# Altium schematic sheet Power_LoadSwitches.SchDoc
size OrCAD B; SheetNumber: 4; SheetTotal: 11
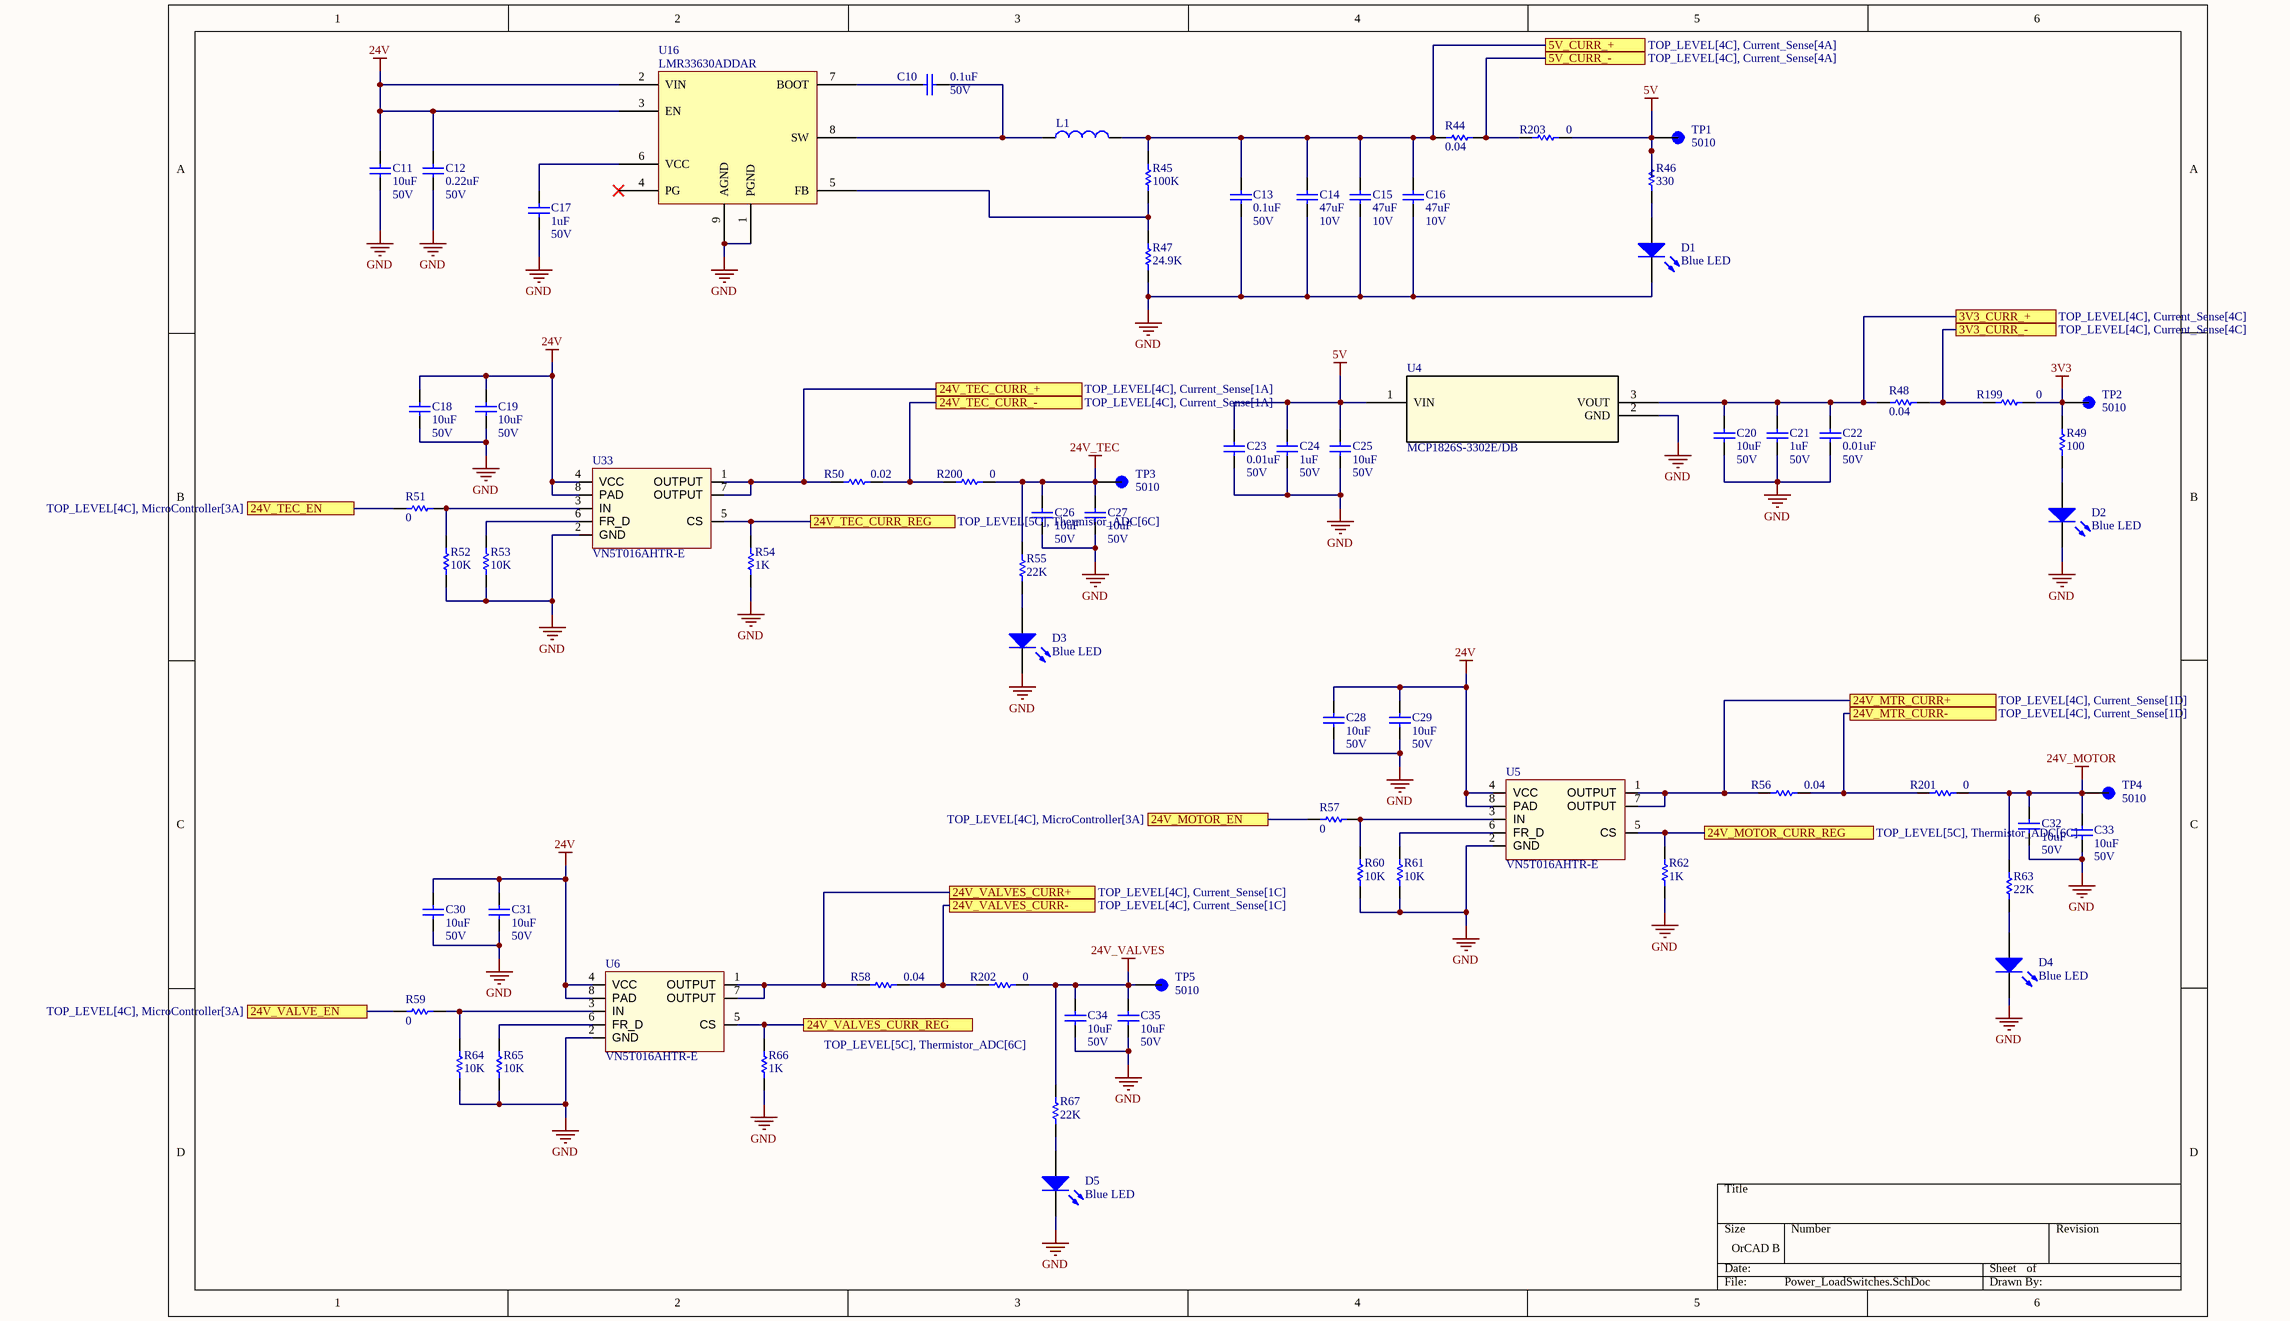
[diagram p0: Power_LoadSwitches.SchDoc]

## Parts
C10  value 0.1uF  Rating: 50V  [DEFAULT_CAPACITOR_0805]  (hidden comment: KGM21NR71H104KT)
C11  value 10uF  Rating: 50V  [DEFAULT_CAPACITOR_0805]  (hidden comment: GRM21BR61H106KE43L)
C12  value 0.22uF  Rating: 50V  [DEFAULT_CAPACITOR_0805]  (hidden comment: C0805C224K5RACTU)
C13  value 0.1uF  Rating: 50V  [DEFAULT_CAPACITOR_0805]  (hidden comment: KGM21NR71H104KT)
C14  value 47uF  Rating: 10V  [DEFAULT_CAPACITOR_0805]  (hidden comment: GRM21BR61A476ME15L)
C15  value 47uF  Rating: 10V  [DEFAULT_CAPACITOR_0805]  (hidden comment: GRM21BR61A476ME15L)
C16  value 47uF  Rating: 10V  [DEFAULT_CAPACITOR_0805]  (hidden comment: GRM21BR61A476ME15L)
C17  value 1uF  Rating: 50V  [DEFAULT_CAPACITOR_0805]  (hidden comment: CL21B105KBFNNNE)
C18  value 10uF  Rating: 50V  [DEFAULT_CAPACITOR_0805]  (hidden comment: GRM21BR61H106KE43L)
C19  value 10uF  Rating: 50V  [DEFAULT_CAPACITOR_0805]  (hidden comment: GRM21BR61H106KE43L)
C20  value 10uF  Rating: 50V  [DEFAULT_CAPACITOR_0805]  (hidden comment: GRM21BR61H106KE43L)
C21  value 1uF  Rating: 50V  [DEFAULT_CAPACITOR_0805]  (hidden comment: CL21B105KBFNNNE)
C22  value 0.01uF  Rating: 50V  [DEFAULT_CAPACITOR_0805]  (hidden comment: KGM21NR71H103KT)
C23  value 0.01uF  Rating: 50V  [DEFAULT_CAPACITOR_0805]  (hidden comment: KGM21NR71H103KT)
C24  value 1uF  Rating: 50V  [DEFAULT_CAPACITOR_0805]  (hidden comment: CL21B105KBFNNNE)
C25  value 10uF  Rating: 50V  [DEFAULT_CAPACITOR_0805]  (hidden comment: GRM21BR61H106KE43L)
C26  value 10uF  Rating: 50V  [DEFAULT_CAPACITOR_0805]  (hidden comment: GRM21BR61H106KE43L)
C27  value 10uF  Rating: 50V  [DEFAULT_CAPACITOR_0805]  (hidden comment: GRM21BR61H106KE43L)
C28  value 10uF  Rating: 50V  [DEFAULT_CAPACITOR_0805]  (hidden comment: GRM21BR61H106KE43L)
C29  value 10uF  Rating: 50V  [DEFAULT_CAPACITOR_0805]  (hidden comment: GRM21BR61H106KE43L)
C30  value 10uF  Rating: 50V  [DEFAULT_CAPACITOR_0805]  (hidden comment: GRM21BR61H106KE43L)
C31  value 10uF  Rating: 50V  [DEFAULT_CAPACITOR_0805]  (hidden comment: GRM21BR61H106KE43L)
C32  value 10uF  Rating: 50V  [DEFAULT_CAPACITOR_0805]  (hidden comment: GRM21BR61H106KE43L)
C33  value 10uF  Rating: 50V  [DEFAULT_CAPACITOR_0805]  (hidden comment: GRM21BR61H106KE43L)
C34  value 10uF  Rating: 50V  [DEFAULT_CAPACITOR_0805]  (hidden comment: GRM21BR61H106KE43L)
C35  value 10uF  Rating: 50V  [DEFAULT_CAPACITOR_0805]  (hidden comment: GRM21BR61H106KE43L)
D1  value Blue LED  [DEFAULT_RESISTOR_0805]  (hidden comment: LSM0805463V)
D2  value Blue LED  [DEFAULT_RESISTOR_0805]  (hidden comment: LSM0805463V)
D3  value Blue LED  [DEFAULT_RESISTOR_0805]  (hidden comment: LSM0805463V)
D4  value Blue LED  [DEFAULT_RESISTOR_0805]  (hidden comment: LSM0805463V)
D5  value Blue LED  [DEFAULT_RESISTOR_0805]  (hidden comment: LSM0805463V)
L1  744771008  [744771008]  (value not drawn)
R44  value 0.04  [DEFAULT_RESISTOR_0805]  (hidden comment: WSLP0805R0400DEA)
R45  value 100K  [DEFAULT_RESISTOR_0805]  (hidden comment: RC0805FR-07100KL)
R46  value 330  [DEFAULT_RESISTOR_0805]  (hidden comment: RMCF0805FT330R)
R47  value 24.9K  [DEFAULT_RESISTOR_0805]  (hidden comment: RMCF0805FT24K9)
R48  value 0.04  [DEFAULT_RESISTOR_0805]  (hidden comment: WSLP0805R0400DEA)
R49  value 100  [DEFAULT_RESISTOR_0805]  (hidden comment: CRCW0805100RFKEA)
R50  value 0.02  [DEFAULT_RESISTOR_0805]  (hidden comment: ERJ-6CWDR020V)
R51  value 0  [DEFAULT_RESISTOR_0805]  (hidden comment: RC0805JR-070RL)
R52  value 10K  [DEFAULT_RESISTOR_0805]  (hidden comment: CRCW080510K0FKEA)
R53  value 10K  [DEFAULT_RESISTOR_0805]  (hidden comment: CRCW080510K0FKEA)
R54  value 1K  [DEFAULT_RESISTOR_0805]  (hidden comment: CRCW08051K00FKEA)
R55  value 22K  [DEFAULT_RESISTOR_0805]  (hidden comment: RC0805FR-1322KL)
R56  value 0.04  [DEFAULT_RESISTOR_0805]  (hidden comment: WSLP0805R0400DEA)
R57  value 0  [DEFAULT_RESISTOR_0805]  (hidden comment: RC0805JR-070RL)
R58  value 0.04  [DEFAULT_RESISTOR_0805]  (hidden comment: WSLP0805R0400DEA)
R59  value 0  [DEFAULT_RESISTOR_0805]  (hidden comment: RC0805JR-070RL)
R60  value 10K  [DEFAULT_RESISTOR_0805]  (hidden comment: CRCW080510K0FKEA)
R61  value 10K  [DEFAULT_RESISTOR_0805]  (hidden comment: CRCW080510K0FKEA)
R62  value 1K  [DEFAULT_RESISTOR_0805]  (hidden comment: CRCW08051K00FKEA)
R63  value 22K  [DEFAULT_RESISTOR_0805]  (hidden comment: RC0805FR-1322KL)
R64  value 10K  [DEFAULT_RESISTOR_0805]  (hidden comment: CRCW080510K0FKEA)
R65  value 10K  [DEFAULT_RESISTOR_0805]  (hidden comment: CRCW080510K0FKEA)
R66  value 1K  [DEFAULT_RESISTOR_0805]  (hidden comment: CRCW08051K00FKEA)
R67  value 22K  [DEFAULT_RESISTOR_0805]  (hidden comment: RC0805FR-1322KL)
R199  value 0  [DEFAULT_RESISTOR_0805]  (hidden comment: RC0805JR-070RL)
R200  value 0  [DEFAULT_RESISTOR_0805]  (hidden comment: RC0805JR-070RL)
R201  value 0  [DEFAULT_RESISTOR_0805]  (hidden comment: RC0805JR-070RL)
R202  value 0  [DEFAULT_RESISTOR_0805]  (hidden comment: RC0805JR-070RL)
R203  value 0  [DEFAULT_RESISTOR_0805]  (hidden comment: RC0805JR-070RL)
TP1  5010  [TP_5011]
TP2  5010  [TP_5011]
TP3  5010  [TP_5011]
TP4  5010  [TP_5011]
TP5  5010  [TP_5011]
U4  MCP1826S-3302E/DB  [MCP1826S-3302E/DB]
U5  VN5T016AHTR-E  [VN5T016AHTR-E-HPAK]
U6  VN5T016AHTR-E  [VN5T016AHTR-E-HPAK]
U16  LMR33630ADDAR  [VREG_LM5017MR/NOPB]
U33  VN5T016AHTR-E  [VN5T016AHTR-E-HPAK]

## Ports
3V3_CURR_+ (see TOP_LEVEL[4C], Current_Sense[4C]), 3V3_CURR_- (see TOP_LEVEL[4C], Current_Sense[4C]), 5V_CURR_+ (see TOP_LEVEL[4C], Current_Sense[4A]), 5V_CURR_- (see TOP_LEVEL[4C], Current_Sense[4A]), 24V_MOTOR_CURR_REG (see TOP_LEVEL[5C], Thermistor_ADC[6C]), 24V_MOTOR_EN (see TOP_LEVEL[4C], MicroController[3A]), 24V_MTR_CURR+ (see TOP_LEVEL[4C], Current_Sense[1D]), 24V_MTR_CURR- (see TOP_LEVEL[4C], Current_Sense[1D]), 24V_TEC_CURR_+ (see TOP_LEVEL[4C], Current_Sense[1A]), 24V_TEC_CURR_- (see TOP_LEVEL[4C], Current_Sense[1A]), 24V_TEC_CURR_REG (see TOP_LEVEL[5C], Thermistor_ADC[6C]), 24V_TEC_EN (see TOP_LEVEL[4C], MicroController[3A]), 24V_VALVE_EN (see TOP_LEVEL[4C], MicroController[3A]), 24V_VALVES_CURR+ (see TOP_LEVEL[4C], Current_Sense[1C]), 24V_VALVES_CURR- (see TOP_LEVEL[4C], Current_Sense[1C]), 24V_VALVES_CURR_REG (see TOP_LEVEL[5C], Thermistor_ADC[6C])

## Nets
3V3: R49.1 R199.1 TP2.TP
5V: C23.2 C24.2 C25.2 R46.1 R203.1 TP1.TP U4.1(VIN)
24V: C11.2 C12.2 C18.2 C19.2 C28.2 C29.2 C30.2 C31.2 U5.4(VCC) U5.8(PAD) U6.4(VCC) U6.8(PAD) U16.2(VIN) U16.3(EN) U33.4(VCC) U33.8(PAD)
24V_MOTOR: C32.2 C33.2 R63.1 R201.1 TP4.TP
24V_TEC: C26.2 C27.2 R55.1 R200.1 TP3.TP
24V_VALVES: C34.2 C35.2 R67.1 R202.1 TP5.TP
GND: C11.1 C12.1 C13.1 C14.1 C15.1 C16.1 C17.1 C18.1 C19.1 C20.1 C21.1 C22.1 C23.1 C24.1 C25.1 C26.1 C27.1 C28.1 C29.1 C30.1 C31.1 C32.1 C33.1 C34.1 C35.1 D1.2(K) D2.2(K) D3.2(K) D4.2(K) D5.2(K) R47.2 R52.2 R53.2 R54.2 R60.2 R61.2 R62.2 R64.2 R65.2 R66.2 U4.2(GND) U5.2(GND) U6.2(GND) U16.1(PGND) U16.9(AGND) U33.2(GND)
3V3_CURR_+: C20.2 C21.2 C22.2 R48.2 U4.3(VOUT) ; port 3V3_CURR_+
3V3_CURR_-: R48.1 R199.2 ; port 3V3_CURR_-
5V_CURR_+: C13.2 C14.2 C15.2 C16.2 L1.2 R44.2 R45.1 ; port 5V_CURR_+
5V_CURR_-: R44.1 R203.2 ; port 5V_CURR_-
24V_MOTOR_CURR_REG: R62.1 U5.5(CS) ; port 24V_MOTOR_CURR_REG
24V_MOTOR_EN: R57.2 ; port 24V_MOTOR_EN
24V_MTR_CURR+: R56.2 U5.1(OUTPUT) U5.7(OUTPUT) ; port 24V_MTR_CURR+
24V_MTR_CURR-: R56.1 R201.2 ; port 24V_MTR_CURR-
24V_TEC_CURR_+: R50.2 U33.1(OUTPUT) U33.7(OUTPUT) ; port 24V_TEC_CURR_+
24V_TEC_CURR_-: R50.1 R200.2 ; port 24V_TEC_CURR_-
24V_TEC_CURR_REG: R54.1 U33.5(CS) ; port 24V_TEC_CURR_REG
24V_TEC_EN: R51.2 ; port 24V_TEC_EN
24V_VALVE_EN: R59.2 ; port 24V_VALVE_EN
24V_VALVES_CURR+: R58.2 U6.1(OUTPUT) U6.7(OUTPUT) ; port 24V_VALVES_CURR+
24V_VALVES_CURR-: R58.1 R202.2 ; port 24V_VALVES_CURR-
24V_VALVES_CURR_REG: R66.1 U6.5(CS) ; port 24V_VALVES_CURR_REG
NetC10_1: C10.1 L1.1 U16.8(SW)
NetC10_2: C10.2 U16.7(BOOT)
NetC17_2: C17.2 U16.6(VCC)
NetD1_1: D1.1(A) R46.2
NetD2_1: D2.1(A) R49.2
NetD3_1: D3.1(A) R55.2
NetD4_1: D4.1(A) R63.2
NetD5_1: D5.1(A) R67.2
NetR45_2: R45.2 R47.1 U16.5(FB)
NetR51_1: R51.1 R52.1 U33.3(IN)
NetR53_1: R53.1 U33.6(FR_D)
NetR57_1: R57.1 R60.1 U5.3(IN)
NetR59_1: R59.1 R64.1 U6.3(IN)
NetR61_1: R61.1 U5.6(FR_D)
NetR65_1: R65.1 U6.6(FR_D)

Not connected (* = marked no-connect by the designer): U16 4(PG)*

## Library data of the parts
C10 C13 = KGM21NR71H104KT: CAP CER 0.1UF 50V X7R 0805; Manufacturer: Cal-Chip Electronics, Inc.; Manufacturer P/N: GMC55X7R226M50NT; MFR PN: KGM21NR71H104KT
C11 C18-C20 C25-C35 = GRM21BR61H106KE43L: CAP CER 10UF 50V X5R 0805; MFR PN: GRM21BR61H106KE43L
C12 = C0805C224K5RACTU: CAP CER 0.22UF 50V X7R 0805; MFR PN: C0805C224K5RACTU
C14-C16 = GRM21BR61A476ME15L: CAP CER 47UF 10V X5R 0805; MFR PN: GRM21BR61A476ME15L
C17 C21 C24 = CL21B105KBFNNNE: CAP CER 1UF 50V X7R 0805; MFR PN: CL21B105KBFNNNE
C22 C23 = KGM21NR71H103KT: CAP CER 10000PF 50V X7R 0805; Manufacturer: Cal-Chip Electronics, Inc.; Manufacturer P/N: GMC55X7R226M50NT; MFR PN: KGM21NR71H103KT
D1-D5 = LSM0805463V: LED BLUE; MP: Blue LED 0805; MFR PN: LSM0805463V
L1 = 744771008: FIXED IND 8.2UH 6.25A 20 MOHM; Value: 8.2uH; MFR PN: 744771008
R44 R48 R56 R58 = WSLP0805R0400DEA: RES 0.04 OHM 0.5% 1/2W 0805; Power: 1/2W; MFR PN: WSLP0805R0400DEA; Tolerance: 0.5%
R45 = RC0805FR-07100KL: RES 100K OHM 1% 1/8W 0805; Power: 1/8W; MFR PN: RC0805FR-07100KL; Tolerance: 1%
R46 = RMCF0805FT330R: RES 330 OHM 1% 1/8W 0805; MFR PN: RMCF0805FT330R; Tolerance: 1%
R47 = RMCF0805FT24K9: RES 24.9K OHM 1% 1/8W 0805; Power: 1/8W; MFR PN: RMCF0805FT24K9; Tolerance: 1%
R49 = CRCW0805100RFKEA: RES SMD 100 OHM 1% 1/4W 0805; Power: 1/4W; MFR PN: CRCW0805100RFKEA; Tolerance: 1%
R50 = ERJ-6CWDR020V: RES 0.02 OHM 0.5% 1/2W 0805; Power: 1/2W; MFR PN: ERJ-6CWDR020V; Tolerance: 0.5%; Parameter 1: *
R51 R57 R59 R199-R203 = RC0805JR-070RL: RES 0 OHM JUMPER 1/8W 0805; Power: 1/8W; MFR PN: RC0805JR-070RL; Tolerance: *
R52 R53 R60 R61 R64 R65 = CRCW080510K0FKEA: RES SMD 10K OHM 1% 1/4W 0805; Power: 1/4W; MFR PN: CRCW080510K0FKEA; Tolerance: 1%
R54 R62 R66 = CRCW08051K00FKEA: RES SMD 1K OHM 1% 1/4W 0805; Power: 1/4W; MFR PN: CRCW08051K00FKEA; Tolerance: 1%
R55 R63 R67 = RC0805FR-1322KL: RES 22K OHM 1% 1/8W 0805; Power: 1/8W; MFR PN: RC0805FR-1322KL; Tolerance: 1%
TP1-TP5 = 5010: PC TEST POINT MULTIPURPOSE RED; MFR PN: 5010
U4 = MCP1826S-3302E/DB: IC REG LINEAR 3.3V 1A SOT-223-3; Manufacturer_Name: Microchip; Copyright: Copyright (C) 2025 Ultra Librarian. All rights reserved.; Manufacturer_Part_Number: MCP1826S-3302E/DB; RefDes: RefDes; Type: Type; MFR PN: MCP1826S-3302E/DB
U5 U6 U33 = VN5T016AHTR-E: Power Switch/Driver 1:1 N-Channel 43A HPAK; Manufacturer: STMicroelectronics; Manufacturer P/N: VN5T016AHTR-E; MFR PN: VN5T016AHTR-E
U16 = LMR33630ADDAR: LMR33630 SIMPLE SWITCHER® 3.8-V to 36-V, 3-A / Synchronous Step-down Voltage Converter; Designer: OMIGA; MP: LMR33630ADDA; MFR PN: LMR33630ADDAR